# EAGLE schematic trashotron-driver-v1 (EAGLE 9.6.2)
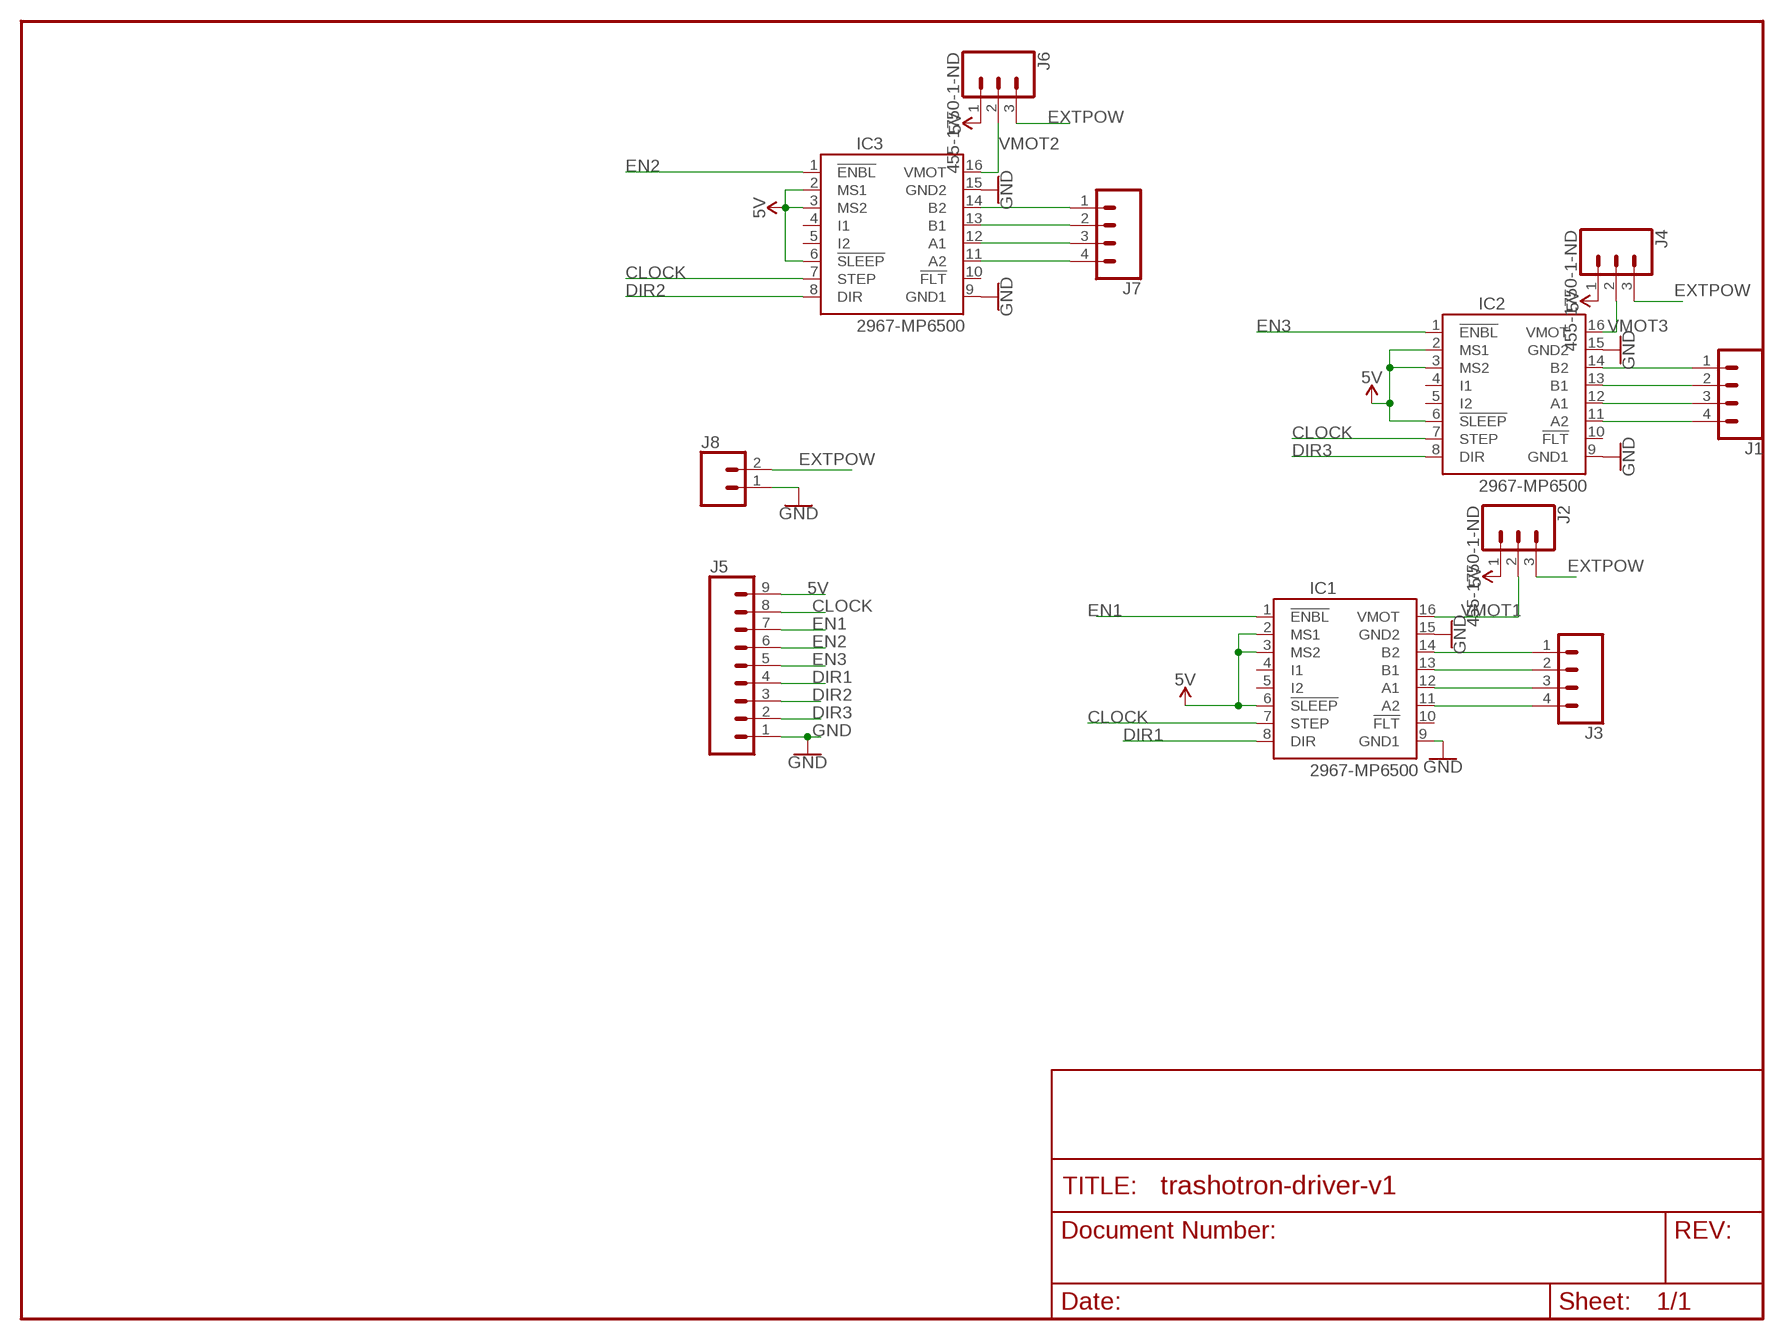
[diagram p0: schematic, sheet 1]

## Parts
IC1  2967-MP6500  [MP6500]
IC2  2967-MP6500  [MP6500]
IC3  2967-MP6500  [MP6500]
J1  CONN_04  [1X04]
J2  455-1750-1-ND  CONN_03  [1X03]
J3  CONN_04  [1X04]
J4  455-1750-1-ND  CONN_03  [1X03]
J5  CONN_09  [1X09]
J6  455-1750-1-ND  CONN_03  [1X03]
J7  CONN_04  [1X04]
J8  CONN_02  [1X02]

## Nets
5V: IC1.2(MS1) IC1.3(MS2) IC1.6(!SLEEP) IC2.2(MS1) IC2.3(MS2) IC2.6(!SLEEP) IC3.2(MS1) IC3.3(MS2) IC3.6(!SLEEP) J2.1 J4.1 J5.9 J6.1
CLOCK: IC1.7(STEP) IC2.7(STEP) IC3.7(STEP) J5.8
DIR1: IC1.8(DIR) J5.4
DIR2: IC3.8(DIR) J5.3
DIR3: IC2.8(DIR) J5.2
EN1: IC1.1(!ENBL) J5.7
EN2: IC3.1(!ENBL) J5.6
EN3: IC2.1(!ENBL) J5.5
EXTPOW: J2.3 J4.3 J6.3 J8.2
GND [vcc]: IC1.9(GND1) IC1.15(GND2) IC2.9(GND1) IC2.15(GND2) IC3.9(GND1) IC3.15(GND2) J5.1 J8.1
N$1: IC3.14(B2) J7.1
N$4: IC3.13(B1) J7.2
N$5: IC1.14(B2) J3.1
N$6: IC1.13(B1) J3.2
N$7: IC1.12(A1) J3.3
N$8: IC1.11(A2) J3.4
N$9: IC2.14(B2) J1.1
N$10: IC2.13(B1) J1.2
N$11: IC2.12(A1) J1.3
N$12: IC2.11(A2) J1.4
N$13: IC3.12(A1) J7.3
N$14: IC3.11(A2) J7.4
VMOT1: IC1.16(VMOT) J2.2
VMOT2: IC3.16(VMOT) J6.2
VMOT3: IC2.16(VMOT) J4.2
Unconnected: IC1.4(I1) IC1.5(I2) IC1.10(!FLT) IC2.4(I1) IC2.5(I2) IC2.10(!FLT) IC3.4(I1) IC3.5(I2) IC3.10(!FLT)

## Library data of the parts
IC1-IC3 = pololu-stepper-driver:2967-MP6500: MP6500 Stepper Motor Driver Carrier; Potentiometer Current Control (Header Pins Soldered) #2967 MP6500 Stepper Motor Driver Carrier; Potentiometer Current Control (Header Pins Soldered) <https://www.pololu.com/product/2967> in Japan, Suzaku Lab. Ltd. <https://suzakugiken.jp/> #2967 MP6500ステッピングモータドライバボード ポテンショメータ式電流制御 (ヘッダーピン実装済み) <https://szc.jp/po2967>
J1 J3 J7 = SparkFun-Connectors:CONN_04: Multi connection point. Often used as Generic Header-pin footprint for 0.1 inch spaced/style header connections On any of the 0.1 inch spaced packages, you can populate with these: Break Away Headers - Straight <https://www.sparkfun.com/products/116> (PRT-00116) Break Away Male Headers - Right Angle <https://www.sparkfun.com/products/553> (PRT-00553) Female Headers <https://www.sparkfun.com/products/115> (PRT-00115) Break Away Headers - Machine Pin <https://www.sparkfun.com/products/117> (PRT-00117) Break Away Female Headers - Swiss Machine Pin <https://www.sparkfun.com/products/743> (PRT-00743) For SCREWTERMINALS and SPRING TERMINALS visit here: Screw Terimnals on SparkFun.com <https://www.sparkfun.com/search/results?term=Screw+Terminals> (5mm/3.5mm/2.54mm spacing) This device is also useful as a general connection point to wire up your design to another part of your project. Our various solder wires solder well into these plated through hole pads. Hook-Up Wire - Assortment (Stranded, 22 AWG) <https://www.sparkfun.com/products/11375> (PRT-11375) Hook-Up Wire - Assortment (Solid Core, 22 AWG) <https://www.sparkfun.com/products/11367> (PRT-11367) View the entire wire category on our website here <https://www.sparkfun.com/categories/141> Special notes: Molex polarized connector foot print use with SKU : PRT-08231 with associated crimp pins and housings. 1MM SMD Version SKU: PRT-10208; PROD_ID: CONN-09696
J2 J4 J6 = SparkFun-Connectors:CONN_03: Multi connection point. Often used as Generic Header-pin footprint for 0.1 inch spaced/style header connections On any of the 0.1 inch spaced packages, you can populate with these: Break Away Headers - Straight <https://www.sparkfun.com/products/116> (PRT-00116) Break Away Male Headers - Right Angle <https://www.sparkfun.com/products/553> (PRT-00553) Female Headers <https://www.sparkfun.com/products/115> (PRT-00115) Break Away Headers - Machine Pin <https://www.sparkfun.com/products/117> (PRT-00117) Break Away Female Headers - Swiss Machine Pin <https://www.sparkfun.com/products/743> (PRT-00743) Stackable Header - 3 Pin (Female, 0.1") <https://www.sparkfun.com/products/13875> (PRT-13875) For SCREWTERMINALS and SPRING TERMINALS visit here: Screw Terimnals on SparkFun.com <https://www.sparkfun.com/search/results?term=Screw+Terminals> (5mm/3.5mm/2.54mm spacing) This device is also useful as a general connection point to wire up your design to another part of your project. Our various solder wires solder well into these plated through hole pads. Hook-Up Wire - Assortment (Stranded, 22 AWG) <https://www.sparkfun.com/products/11375> (PRT-11375) Hook-Up Wire - Assortment (Solid Core, 22 AWG) <https://www.sparkfun.com/products/11367> (PRT-11367) View the entire wire category on our website here <https://www.sparkfun.com/categories/141> Special notes: Molex polarized connector foot print use with SKU : PRT-08232 with associated crimp pins and housings.; PROD_ID: XXX-00000
J5 = SparkFun-Connectors:CONN_09: Multi connection point. Often used as Generic Header-pin footprint for 0.1 inch spaced/style header connections On any of the 0.1 inch spaced packages, you can populate with these: Break Away Headers - Straight <https://www.sparkfun.com/products/116> (PRT-00116) Break Away Male Headers - Right Angle <https://www.sparkfun.com/products/553> (PRT-00553) Female Headers <https://www.sparkfun.com/products/115> (PRT-00115) Break Away Headers - Machine Pin <https://www.sparkfun.com/products/117> (PRT-00117) Break Away Female Headers - Swiss Machine Pin <https://www.sparkfun.com/products/743> (PRT-00743) For SCREWTERMINALS and SPRING TERMINALS visit here: Screw Terimnals on SparkFun.com <https://www.sparkfun.com/search/results?term=Screw+Terminals> (5mm/3.5mm/2.54mm spacing) This device is also useful as a general connection point to wire up your design to another part of your project. Our various solder wires solder well into these plated through hole pads. Hook-Up Wire - Assortment (Stranded, 22 AWG) <https://www.sparkfun.com/products/11375> (PRT-11375) Hook-Up Wire - Assortment (Solid Core, 22 AWG) <https://www.sparkfun.com/products/11367> (PRT-11367) View the entire wire category on our website here <https://www.sparkfun.com/categories/141> Special notes: Molex polarized connector foot print use with SKU : PRT-08231 with associated crimp pins and housings. 1MM SMD Version SKU: PRT-10208 NOTES ON THE VARIANTS LOCK and LOCK_LONGPADS... This footprint was designed to help hold the alignment of a through-hole component (i.e. 6-pin header) while soldering it into place. You may notice that each hole has been shifted either up or down by 0.005 of an inch from it's more standard position (which is a perfectly straight line). This slight alteration caused the pins (the squares in the middle) to touch the edges of the holes. Because they are alternating, it causes a "brace" to hold the component in place. 0.005 has proven to be the perfect amount of "off-center" position when using our standard breakaway headers. Although looks a little odd when you look at the bare footprint, once you have a header in there, the alteration is very hard to notice. Also,if you push a header all the way into place, it is covered up entirely on the bottom side.
J8 = SparkFun-Connectors:CONN_02: Multi connection point. Often used as Generic Header-pin footprint for 0.1 inch spaced/style header connections On any of the 0.1 inch spaced packages, you can populate with these: Break Away Headers - Straight <https://www.sparkfun.com/products/116> (PRT-00116) Break Away Male Headers - Right Angle <https://www.sparkfun.com/products/553> (PRT-00553) Female Headers <https://www.sparkfun.com/products/115> (PRT-00115) Break Away Headers - Machine Pin <https://www.sparkfun.com/products/117> (PRT-00117) Break Away Female Headers - Swiss Machine Pin <https://www.sparkfun.com/products/743> (PRT-00743) For SCREWTERMINALS and SPRING TERMINALS visit here: Screw Terimnals on SparkFun.com <https://www.sparkfun.com/search/results?term=Screw+Terminals> (5mm/3.5mm/2.54mm spacing) This device is also useful as a general connection point to wire up your design to another part of your project. Our various solder wires solder well into these plated through hole pads. Hook-Up Wire - Assortment (Stranded, 22 AWG) <https://www.sparkfun.com/products/11375> (PRT-11375) Hook-Up Wire - Assortment (Solid Core, 22 AWG) <https://www.sparkfun.com/products/11367> (PRT-11367) View the entire wire category on our website here <https://www.sparkfun.com/categories/141> Special notes: Molex polarized connector foot print use with: PRT-08233 with associated crimp pins and housings. 2.54_SCREWTERM for use with PRT-10571. 3.5mm Screw Terminal footprints for PRT-08084 5mm Screw Terminal footprints for use with PRT-08432

## Net classes
0 Default: width 0.178 mm
1 vcc: width 0.178 mm